# Altium project PCB_Padometer.PrjPcb
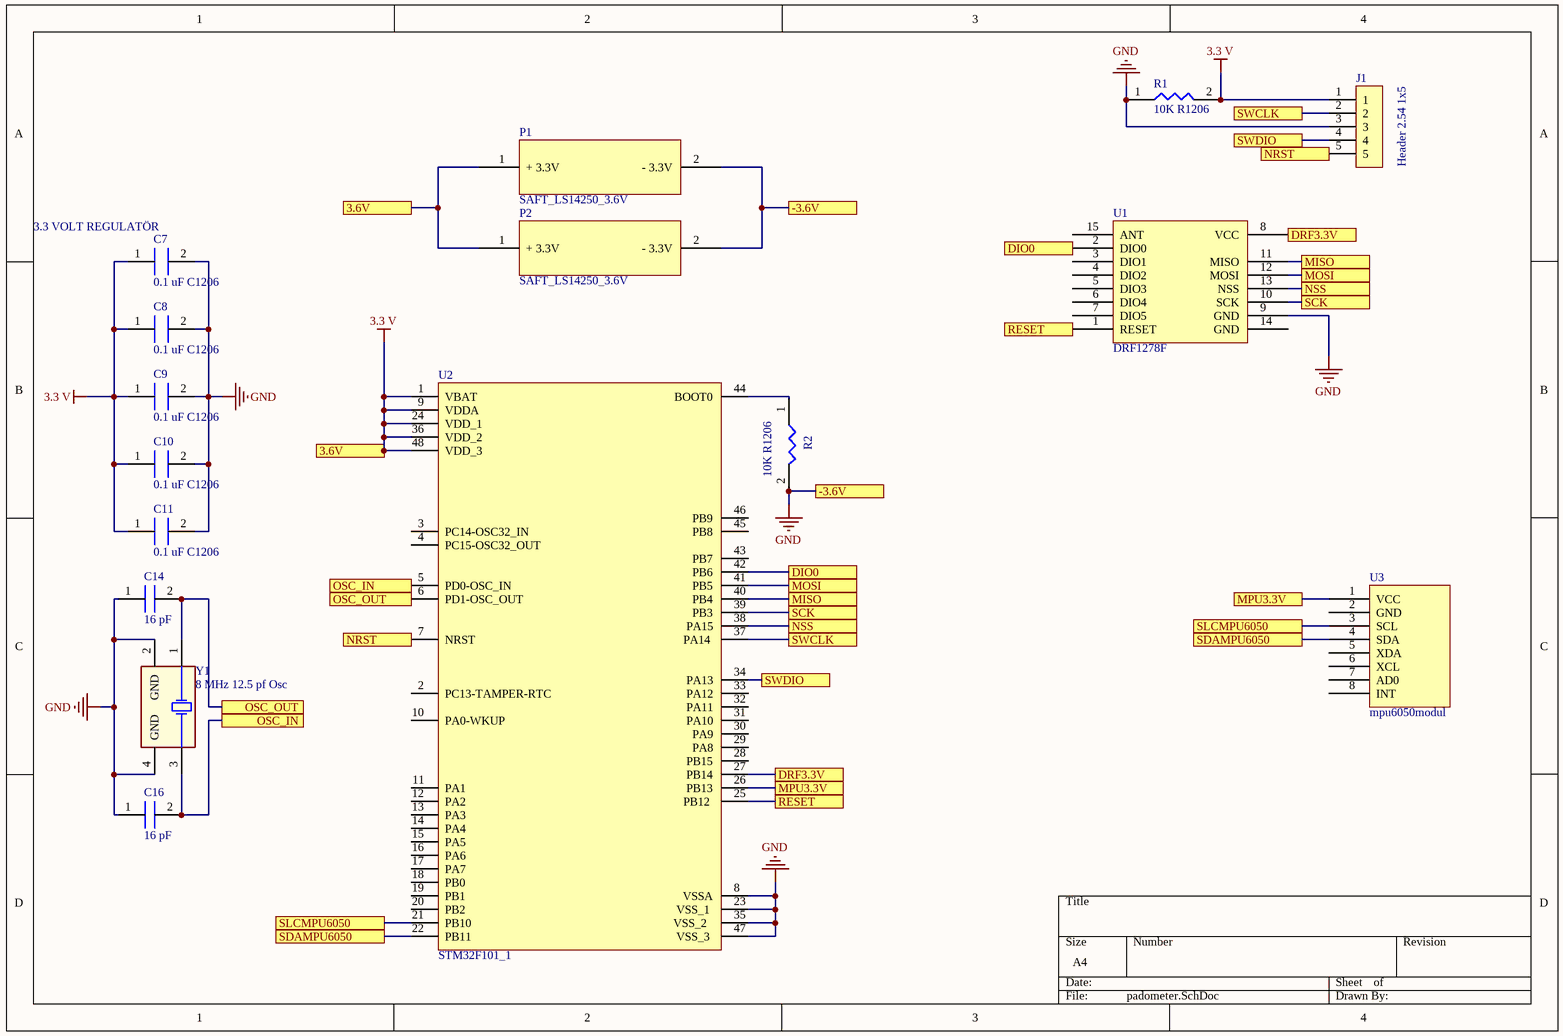
[diagram p0: padometer.SchDoc]
1 sheet, 16 parts. Net scope: flat (ports and power ports of the same name join across sheets).
Board file: PCBPadometer.PcbDoc

## Sheet padometer.SchDoc
size A4

### Parts
C7  0.1 uF C1206  [C1206]
C8  0.1 uF C1206  [C1206]
C9  0.1 uF C1206  [C1206]
C10  0.1 uF C1206  [C1206]
C11  0.1 uF C1206  [C1206]
C14  16 pF  [C1206]
C16  16 pF  [C1206]
J1  Header 2.54 1x5  [Header 2.54 1x5]
P1  SAFT_LS14250_3.6V  [SAFT_LS14250_3.6V]
P2  SAFT_LS14250_3.6V  [SAFT_LS14250_3.6V]
R1  10K R1206  [R1206 Resıstor]
R2  10K R1206  [R1206 Resıstor]
U1  DRF1278F  [DRF1278F]
U2  STM32F101_1  [LQFP48-STM]
U3  mpu6050modul  [MPU6050MODUL]
Y1  8 MHz 12.5 pf Osc  [8 MHZ Osc.]

### Ports
3.6V, -3.6V, DIO0, DRF3.3V, MISO, MOSI, MPU3.3V, NRST, NSS, OSC_IN, OSC_OUT, RESET, SCK, SDAMPU6050, SLCMPU6050, SWCLK, SWDIO

### Nets
3.3 V: C7.1 C8.1 C9.1 C10.1 C11.1 J1.1 P1.1(+_3.3V) P2.1(+_3.3V) R1.2 U2.1(VBAT) U2.9(VDDA) U2.24(VDD_1) U2.36(VDD_2) U2.48(VDD_3) ; port 3.6V
GND: C7.2 C8.2 C9.2 C10.2 C11.2 C14.1 C16.1 J1.3 P1.2(-_3.3V) P2.2(-_3.3V) R1.1 R2.2 U1.9(GND) U2.8(VSSA) U2.23(VSS_1) U2.35(VSS_2) U2.47(VSS_3) Y1.2(GND) Y1.4(GND) ; port -3.6V
NetC14_2: C14.2 U2.6(PD1-OSC_OUT) Y1.1 ; port OSC_OUT
NetC16_2: C16.2 U2.5(PD0-OSC_IN) Y1.3 ; port OSC_IN
NetJ1_2: J1.2 U2.37(PA14) ; port SWCLK
NetJ1_4: J1.4 U2.34(PA13) ; port SWDIO
NetJ1_5: J1.5 U2.7(NRST) ; port NRST
NetR2_1: R2.1 U2.44(BOOT0)
NetU1_1: U1.1(RESET) U2.25(PB12) ; port RESET
NetU1_2: U1.2(DIO0) U2.42(PB6) ; port DIO0
NetU1_8: U1.8(VCC) U2.27(PB14) ; port DRF3.3V
NetU1_10: U1.10(SCK) U2.39(PB3) ; port SCK
NetU1_11: U1.11(MISO) U2.40(PB4) ; port MISO
NetU1_12: U1.12(MOSI) U2.41(PB5) ; port MOSI
NetU1_13: U1.13(NSS) U2.38(PA15) ; port NSS
NetU2_21: U2.21(PB10) U3.3(SCL) ; port SLCMPU6050
NetU2_22: U2.22(PB11) U3.4(SDA) ; port SDAMPU6050
NetU2_26: U2.26(PB13) U3.1(VCC) ; port MPU3.3V

Not connected (* = marked no-connect by the designer): U1 3(DIO1) 4(DIO2) 5(DIO3) 6(DIO4) 7(DIO5) 14(GND) 15(ANT); U2 2(PC13-TAMPER-RTC) 3(PC14-OSC32_IN) 4(PC15-OSC32_OUT) 10(PA0-WKUP) 11(PA1) 12(PA2) 13(PA3) 14(PA4) 15(PA5) 16(PA6) 17(PA7) 18(PB0) 19(PB1) 20(PB2) 28(PB15) 29(PA8) 30(PA9) 31(PA10) 32(PA11) 33(PA12) 43(PB7) 45(PB8) 46(PB9); U3 2(GND) 5(XDA) 6(XCL) 7(AD0) 8(INT)

### Notes on the sheet
- (near C7) 3.3 VOLT REGULATÖR

### Library data of the parts
U2 = STM32F101_1: STM32F101 48 PİNLİ MİKROİŞLEMCİ